# Altium schematic sheet four_axis_part3.SchDoc
size A4
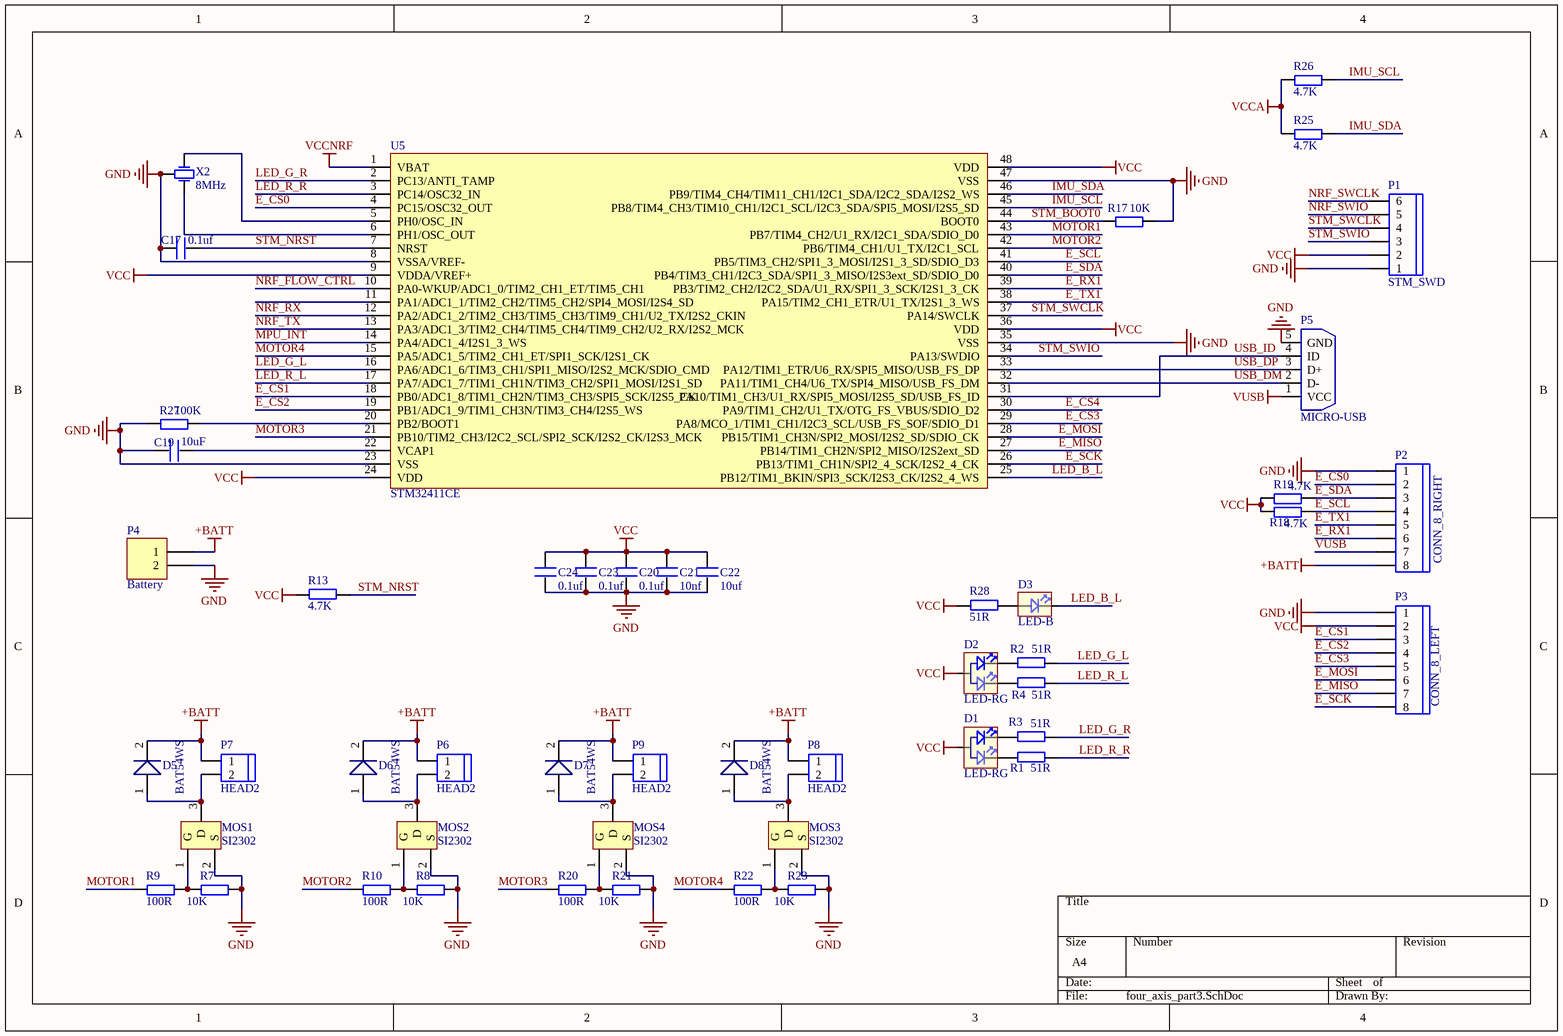
[diagram p0: four_axis_part3.SchDoc]

## Parts
C17  0.1uf  [0603P]
C19  10uF  [0603P]
C20  0.1uf  [0603P]
C21  10nf  [0603P]
C22  10uf  [0603P]
C23  0.1uf  [0603P]
C24  0.1uf  [0603P]
D1  LED-RG  [LED1206  侧贴]
D2  LED-RG  [LED1206  侧贴]
D3  LED-B  [LED1206  侧贴]
D5  BAT54WS  [SOD-323]
D6  BAT54WS  [SOD-323]
D7  BAT54WS  [SOD-323]
D8  BAT54WS  [SOD-323]
MOS1  SI2302  [SO-G3/C2.5]
MOS2  SI2302  [SO-G3/C2.5]
MOS3  SI2302  [SO-G3/C2.5]
MOS4  SI2302  [SO-G3/C2.5]
P1  STM_SWD  [SH1.0-6P]
P2  CONN_8_RIGHT  [HEADER8-2.0MM]
P3  CONN_8_LEFT  [HEADER8-2.0MM]
P4  Battery  [HDR1X2]
P5  MICRO-USB  [MICRO_USB5P_SOP]
P6  HEAD2  [HEADER2-1.25MM]
P7  HEAD2  [HEADER2-1.25MM]
P8  HEAD2  [HEADER2-1.25MM]
P9  HEAD2  [HEADER2-1.25MM]
R1  51R  [0402]
R2  51R  [0402]
R3  51R  [0402]
R4  51R  [0402]
R7  10K  [0402]
R8  10K  [0402]
R9  100R  [0402]
R10  100R  [0402]
R13  4.7K  [0402]
R17  10K  [0402]
R18  4.7K  [0402]
R19  4.7K  [0402]
R20  100R  [0402]
R21  10K  [0402]
R22  100R  [0402]
R23  10K  [0402]
R25  4.7K  [0402]
R26  4.7K  [0402]
R27  100K  [0402]
R28  51R  [0402]
U5  STM32411CE  [UFQFPN48]
X2  8MHz  [XTAL3215]

## Nets
+BATT: D5.2 D6.2 D7.2 D8.2 P2.8 P4.1 P6.1 P7.1 P8.1 P9.1
GND: C17.1 C19.1 C20.1 C21.1 C22.1 C23.1 C24.1 MOS1.2(S) MOS2.2(S) MOS3.2(S) MOS4.2(S) P1.1 P2.1 P3.1 P4.2 P5.5(GND) R7.2 R8.2 R17.2 R21.2 R23.2 R27.1 U5.8(VSSA/VREF-) U5.23(VSS) U5.35(VSS) U5.47(VSS) X2.2(GND)
VCC: C20.2 C21.2 C22.2 C23.2 C24.2 D1.3 D2.3 P1.2 P3.2 R13.2 R18.1 R19.1 R28.2 U5.9(VDDA/VREF+) U5.24(VDD) U5.36(VDD) U5.48(VDD)
VCCA: R25.1 R26.1
VCCNRF: U5.1(VBAT)
VUSB: P2.7 P5.1(VCC)
E_CS0: P2.2 U5.4(PC15/OSC32_OUT)
E_CS1: P3.3 U5.18(PB0/ADC1_8/TIM1_CH2N/TIM3_CH3/SPI5_SCK/I2S5_CK)
E_CS2: P3.4 U5.19(PB1/ADC1_9/TIM1_CH3N/TIM3_CH4/I2S5_WS)
E_CS3: P3.5 U5.29(PA8/MCO_1/TIM1_CH1/I2C3_SCL/USB_FS_SOF/SDIO_D1)
E_CS4: U5.30(PA9/TIM1_CH2/U1_TX/OTG_FS_VBUS/SDIO_D2)
E_MISO: P3.7 U5.27(PB14/TIM1_CH2N/SPI2_MISO/I2S2ext_SD)
E_MOSI: P3.6 U5.28(PB15/TIM1_CH3N/SPI2_MOSI/I2S2_SD/SDIO_CK)
E_RX1: P2.6 U5.39(PB3/TIM2_CH2/I2C2_SDA/U1_RX/SPI1_3_SCK/I2S1_3_CK)
E_SCK: P3.8 U5.26(PB13/TIM1_CH1N/SPI2_4_SCK/I2S2_4_CK)
E_SCL: P2.4 R18.2 U5.41(PB5/TIM3_CH2/SPI1_3_MOSI/I2S1_3_SD/SDIO_D3)
E_SDA: P2.3 R19.2 U5.40(PB4/TIM3_CH1/I2C3_SDA/SPI1_3_MISO/I2S3ext_SD/SDIO_D0)
E_TX1: P2.5 U5.38(PA15/TIM2_CH1_ETR/U1_TX/I2S1_3_WS)
IMU_SCL: R26.2 U5.45(PB8/TIM4_CH3/TIM10_CH1/I2C1_SCL/I2C3_SDA/SPI5_MOSI/I2S5_SD)
IMU_SDA: R25.2 U5.46(PB9/TIM4_CH4/TIM11_CH1/I2C1_SDA/I2C2_SDA/I2S2_WS)
LED_B_L: D3.1 U5.25(PB12/TIM1_BKIN/SPI3_SCK/I2S3_CK/I2S2_4_WS)
LED_G_L: R2.1 U5.16(PA6/ADC1_6/TIM3_CH1/SPI1_MISO/I2S2_MCK/SDIO_CMD)
LED_G_R: R3.1 U5.2(PC13/ANTI_TAMP)
LED_R_L: R4.1 U5.17(PA7/ADC1_7/TIM1_CH1N/TIM3_CH2/SPI1_MOSI/I2S1_SD)
LED_R_R: R1.1 U5.3(PC14/OSC32_IN)
MOTOR1: R9.1 U5.43(PB7/TIM4_CH2/U1_RX/I2C1_SDA/SDIO_D0)
MOTOR2: R10.1 U5.42(PB6/TIM4_CH1/U1_TX/I2C1_SCL)
MOTOR3: R20.1 U5.21(PB10/TIM2_CH3/I2C2_SCL/SPI2_SCK/I2S2_CK/I2S3_MCK)
MOTOR4: R22.1 U5.15(PA5/ADC1_5/TIM2_CH1_ET/SPI1_SCK/I2S1_CK)
MPU_INT: U5.14(PA4/ADC1_4/I2S1_3_WS)
NRF_FLOW_CTRL: U5.10(PA0-WKUP/ADC1_0/TIM2_CH1_ET/TIM5_CH1)
NRF_RX: U5.12(PA2/ADC1_2/TIM2_CH3/TIM5_CH3/TIM9_CH1/U2_TX/I2S2_CKIN)
NRF_SWCLK: P1.6
NRF_SWIO: P1.5
NRF_TX: U5.13(PA3/ADC1_3/TIM2_CH4/TIM5_CH4/TIM9_CH2/U2_RX/I2S2_MCK)
STM_BOOT0: R17.1 U5.44(BOOT0)
STM_NRST: C17.2 R13.1 U5.7(NRST)
STM_SWCLK: P1.4 U5.37(PA14/SWCLK)
STM_SWIO: P1.3 U5.34(PA13/SWDIO)
USB_DM: P5.2(D-) U5.32(PA11/TIM1_CH4/U6_TX/SPI4_MISO/USB_FS_DM)
USB_DP: P5.3(D+) U5.33(PA12/TIM1_ETR/U6_RX/SPI5_MISO/USB_FS_DP)
USB_ID: P5.4(ID) U5.31(PA10/TIM1_CH3/U1_RX/SPI5_MOSI/I2S5_SD/USB_FS_ID)
NetC19_2: C19.2 U5.22(VCAP1)
NetD1_1: D1.1 R1.2
NetD1_2: D1.2 R3.2
NetD2_1: D2.1 R4.2
NetD2_2: D2.2 R2.2
NetD3_3: D3.3 R28.1
NetD5_1: D5.1 MOS1.3(D) P7.2
NetD6_1: D6.1 MOS2.3(D) P6.2
NetD7_1: D7.1 MOS4.3(D) P9.2
NetD8_1: D8.1 MOS3.3(D) P8.2
NetMOS1_1: MOS1.1(G) R7.1 R9.2
NetMOS2_1: MOS2.1(G) R8.1 R10.2
NetMOS3_1: MOS3.1(G) R22.2 R23.1
NetMOS4_1: MOS4.1(G) R20.2 R21.1
NetR27_2: R27.2 U5.20(PB2/BOOT1)
NetU5_5: U5.5(PH0/OSC_IN) X2.1(OSC1)
NetU5_6: U5.6(PH1/OSC_OUT) X2.3(OSC2)

Not connected (* = marked no-connect by the designer): D3 2; U5 11(PA1/ADC1_1/TIM2_CH2/TIM5_CH2/SPI4_MOSI/I2S4_SD)

## Library data of the parts
C17 C19-C24 = C
D1 D2 = LED 1206 侧贴 双色
D3 = LED 1206 侧贴  单色
D5-D8 = BAT54: 单肖特基二极管
MOS1-MOS4 = MOS-N: AP2306
P1 = HEAD6
P2 P3 = HEAD8
P4 = Header 2: Header, 2-Pin; LatestRevisionDate: 17-Jul-2002; LatestRevisionNote: Re-released for DXP Platform.; Publisher: Altium Limited
P5 = USB5
R1-R4 R7-R10 R13 R17-R23 R25-R28 = R
U5 = STM32F411xC_xE: STM32411xC_xE
X2 = XTAL-3215